# EAGLE design sb7pads (EAGLE 9.4.2)
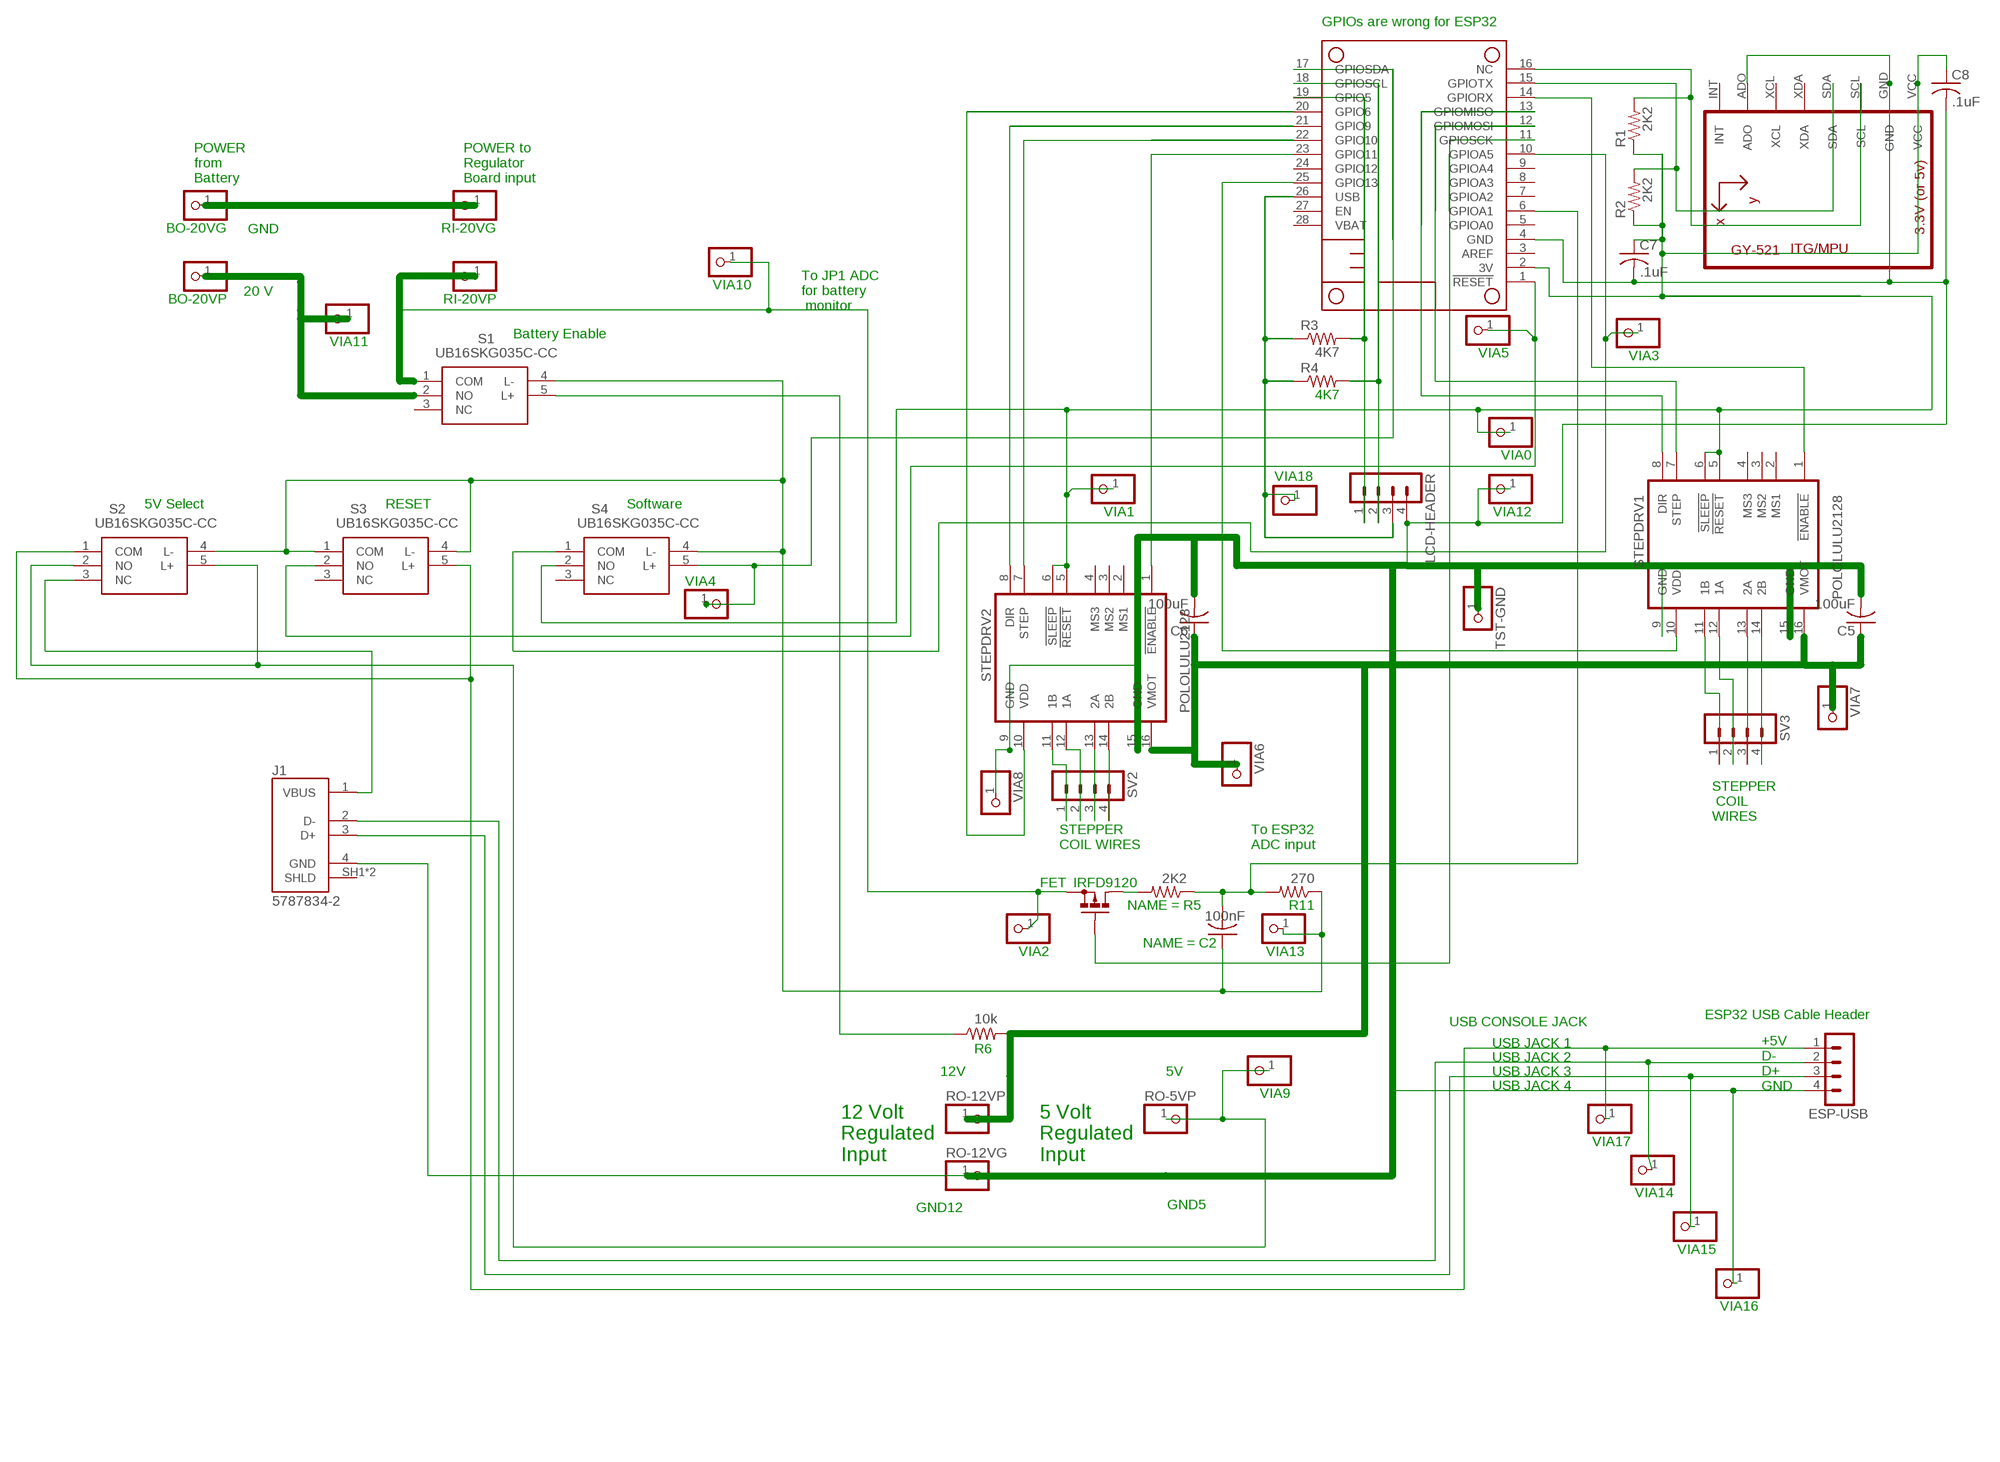
[diagram p0: schematic, sheet 1]

## Parts
BO-20VG  PINHD-1X1  [1X01]
BO-20VP  PINHD-1X1  [1X01]
C2  100nF  C-US050-025X075  [C050-025X075]
C5  100uF  C-US050-024X044  [C050-024X044]
C6  100uF  C-US050-024X044  [C050-024X044]
C7  .1uF  C-US050-024X044  [C050-024X044]
C8  .1uF  C-US050-024X044  [C050-024X044]
ESP-USB  MA04-1  [MA04-1]
FET  IRFD9120  [C370-01]
J1  5787834-2  [TE_5787834-2]
LCD-HEADER  MA04-1  [MA04-1]
MS2  FEATHERWING_NOHOLES  [FEATHERWING_NOHOLES]
R1  2K2  R-US_0309/12  [0309/12]
R2  2K2  R-US_0309/12  [0309/12]
R3  4K7  R-US_0309/12  [0309/12]
R4  4K7  R-US_0309/12  [0309/12]
R5  2K2  R-US_0207/10  [0207/10]
R6  10k  R-US_0207/10  [0207/10]
R11  270  R-US_0207/10  [0207/10]
RI-20VG  PINHD-1X1  [1X01]
RI-20VP  PINHD-1X1  [1X01]
RO-5VP  PINHD-1X1  [1X01]
RO-12VG  PINHD-1X1  [1X01]
RO-12VP  PINHD-1X1  [1X01]
S1  UB16SKG035C-CC  [UB16SKG035CCC]
S2  UB16SKG035C-CC  [UB16SKG035CCC]
S3  UB16SKG035C-CC  [UB16SKG035CCC]
S4  UB16SKG035C-CC  [UB16SKG035CCC]
STEPDRV1  POLOLULU2128  [POLOLULU2128]
STEPDRV2  POLOLULU2128  [POLOLULU2128]
SV2  MA04-1  [MA04-1]
SV3  MA04-1  [MA04-1]
TST-GND  PINHD-1X1  [1X01]
U1  GY-521MPU6050  [GY-521]
VIA0  PINHD-1X1  [1X01]
VIA1  PINHD-1X1  [1X01]
VIA2  PINHD-1X1  [1X01]
VIA3  PINHD-1X1  [1X01]
VIA4  PINHD-1X1  [1X01]
VIA5  PINHD-1X1  [1X01]
VIA6  PINHD-1X1  [1X01]
VIA7  PINHD-1X1  [1X01]
VIA8  PINHD-1X1  [1X01]
VIA9  PINHD-1X1  [1X01]
VIA10  PINHD-1X1  [1X01]
VIA11  PINHD-1X1  [1X01]
VIA12  PINHD-1X1  [1X01]
VIA13  PINHD-1X1  [1X01]
VIA14  PINHD-1X1  [1X01]
VIA15  PINHD-1X1  [1X01]
VIA16  PINHD-1X1  [1X01]
VIA17  PINHD-1X1  [1X01]
VIA18  PINHD-1X1  [1X01]

## Nets
3V: C7.1 C8.1 MS2.2(3V) R1.1 R2.1 S4.2(NO) STEPDRV1.5(!RESET) STEPDRV1.6(!SLEEP) STEPDRV2.5(!RESET) STEPDRV2.6(!SLEEP) U1.VCC VIA0.1 VIA1.1
N$1: MS2.25(GPIO13) STEPDRV1.10(VDD)
N$2: FET.G MS2.11(GPIOSCK)
N$3: BO-20VP.1 S1.2(NO) VIA11.1
N$4: MS2.1(!RESET) S3.2(NO) VIA5.1
N$5: MS2.21(GPIO9) STEPDRV2.8(DIR)
N$6: FET.S RI-20VP.1 S1.1(COM) VIA2.1 VIA10.1
N$7: MS2.14(GPIORX) STEPDRV1.1(!ENABLE)
N$8: STEPDRV2.14(2B) SV2.4
N$11: LCD-HEADER.1 MS2.19(GPIO5) R3.2
N$12: STEPDRV2.13(2A) SV2.3
N$13: STEPDRV2.12(1A) SV2.2
N$14: STEPDRV2.11(1B) SV2.1
N$15: MS2.12(GPIOMOSI) STEPDRV1.7(STEP)
N$16: STEPDRV1.14(2B) SV3.4
N$17: MS2.16(NC) R1.2 U1.SCL
N$18: STEPDRV1.13(2A) SV3.3
N$19: STEPDRV1.12(1A) SV3.2
N$20: STEPDRV1.11(1B) SV3.1
N$21: BO-20VG.1 RI-20VG.1
N$22: ESP-USB.2 J1.2(D-) VIA14.1
N$23: ESP-USB.3 J1.3(D+) VIA15.1
N$24: MS2.13(GPIOMISO) STEPDRV1.8(DIR)
N$25: MS2.15(GPIOTX) R2.2 U1.SDA
N$27: C5.2 C6.2 C7.2 C8.2 ESP-USB.4 J1.4(GND) LCD-HEADER.4 MS2.4(GND) RO-12VG.1 STEPDRV1.9(GND) STEPDRV1.15(GND) STEPDRV2.9(GND) STEPDRV2.15(GND) TST-GND.1 U1.ADO U1.GND VIA8.1 VIA12.1 VIA16.1
N$28: RO-5VP.1 S2.2(NO) S2.5(L+) VIA9.1
N$29: MS2.17(GPIOSDA) S4.5(L+) VIA4.1
N$30: C2.2 MS2.6(GPIOA1) R5.1 R11.2
N$31: R6.1 S1.5(L+)
N$33: ESP-USB.1 S2.1(COM) S3.5(L+) VIA17.1
N$34: MS2.22(GPIO10) STEPDRV2.7(STEP)
N$35: LCD-HEADER.2 MS2.18(GPIOSCL) R4.2
N$36: MS2.20(GPIO6) STEPDRV2.10(VDD)
N$37: MS2.23(GPIO11) STEPDRV2.1(!ENABLE)
N$44: MS2.10(GPIOA5) S4.1(COM) VIA3.1
N$45: C5.1 C6.1 R6.2 RO-12VP.1 STEPDRV1.16(VMOT) STEPDRV2.16(VMOT) VIA6.1 VIA7.1
N$50: J1.1(VBUS) S2.3(NC)
N$51: FET.D FET.D1(D) R5.2
N$56: C2.1 R11.1 S1.4(L-) S2.4(L-) S3.1(COM) S3.4(L-) S4.4(L-) VIA13.1
USB: LCD-HEADER.3 MS2.26(USB) R3.1 R4.1 VIA18.1
Unconnected: J1.SH1(SHLD) J1.SH2(SHLD) MS2.3(AREF) MS2.5(GPIOA0) MS2.7(GPIOA2) MS2.8(GPIOA3) MS2.9(GPIOA4) MS2.24(GPIO12) MS2.27(EN) MS2.28(VBAT) S1.3(NC) S3.3(NC) S4.3(NC) STEPDRV1.2(MS1) STEPDRV1.3(MS2) STEPDRV1.4(MS3) STEPDRV2.2(MS1) STEPDRV2.3(MS2) STEPDRV2.4(MS3) U1.INT U1.XCL U1.XDA

## Notes on the sheet
- GPIOs are wrong for ESP32
- POWER
  from
  Battery
- POWER to
  Regulator
  Board input
- GND
- 20 V
- To JP1 ADC
  for battery
   monitor
- Battery Enable
- 5V Select | RESET | Software
- STEPPER
   COIL
  WIRES
- STEPPER
  COIL WIRES
- To ESP32
  ADC input
- ESP32 USB Cable Header
- USB CONSOLE JACK
- USB JACK 1
- USB JACK 2
- 12V | 5V | USB JACK 3
- USB JACK 4
- +5V
  D-
  D+
  GND
- 12 Volt
  Regulated
  Input
- 5 Volt
  Regulated
  Input
- GND12 | GND5

## Library data of the parts
BO-20VG BO-20VP RI-20VG RI-20VP RO-5VP RO-12VG RO-12VP TST-GND VIA0 VIA1-VIA18 = pinhead:PINHD-1X1: PIN HEADER
C2 C5-C8 = rcl:C-US: CAPACITOR, American symbol; SPICEPREFIX: C
ESP-USB LCD-HEADER SV2 SV3 = con-lstb:MA04-1: PIN HEADER; OC_FARNELL: unknown; OC_NEWARK: unknown
FET = transistor-small-signal:IRFD9120: P-CHANNEL MOS FET
J1 = 5787834-2:5787834-2: Conn USB 2.0 Type B RCP 4 POS 2.5mm Solder ST Thru-Hole 4 Terminal 1 Port Box/Tray; COMMENT: 5787834-2; DESCRIPTION: Conn USB 2.0 Type B RCP 4 POS 2.5mm Solder ST Thru-Hole 4 Terminal 1 Port Box/Tray; DIGI-KEY_PART_NUMBER: A121598-ND; DIGI-KEY_PURCHASE_URL: https://www.digikey.com/product-detail/en/te-connectivity-amp-connectors/5787834-2/A121598-ND/2286710?utm_source=snapeda&utm_medium=aggregator&utm_campaign=symbol; EU_ROHS_COMPLIANCE: Compliant; MF: TE Connectivity; MP: 5787834-2; PACKAGE: None; TE_PURCHASE_URL: https://www.te.com/usa-en/product-5787834-2.html?te_bu=Cor&te_type=disp&te_campaign=seda_glo_cor-seda-global-disp-prtnr-fy19-seda-model-bom-cta_sma-317_1&elqCampaignId=32493
MS2 = microbuilder:FEATHERWING
R1-R4 = resistor:R-US_: RESISTOR, American symbol
R5 R6 R11 = rcl:R-US_: RESISTOR, American symbol; SPICEPREFIX: R
S1-S4 = UB16SKG035C-CC:UB16SKG035C-CC: Pushbutton Switches ON-ON SQ .4VA RED LED & CAP PC TERM Source: Datasheet <https://www.mouser.com/datasheet/2/295/UBIlluminated-33436.pdf>; ALLIED_NUMBER: 71044456; ALLIED_PRICE-STOCK: https://www.alliedelec.com/nkkswitches-ub16skg035c-cc/71044456/; DESCRIPTION: Pushbutton Switches ON-ON SQ .4VA RED LED & CAP PC TERM; HEIGHT: 13.5mm; MANUFACTURER_NAME: NKK Switches; MANUFACTURER_PART_NUMBER: UB16SKG035C-CC; MOUSER_PART_NUMBER: 633-UB16SKG035CCC; MOUSER_PRICE-STOCK: https://www.mouser.com/Search/Refine.aspx?Keyword=633-UB16SKG035CCC
STEPDRV1 STEPDRV2 = stepper_drivers_etc:POLOLULU2128
U1 = gy-521a:GY-521

## Board
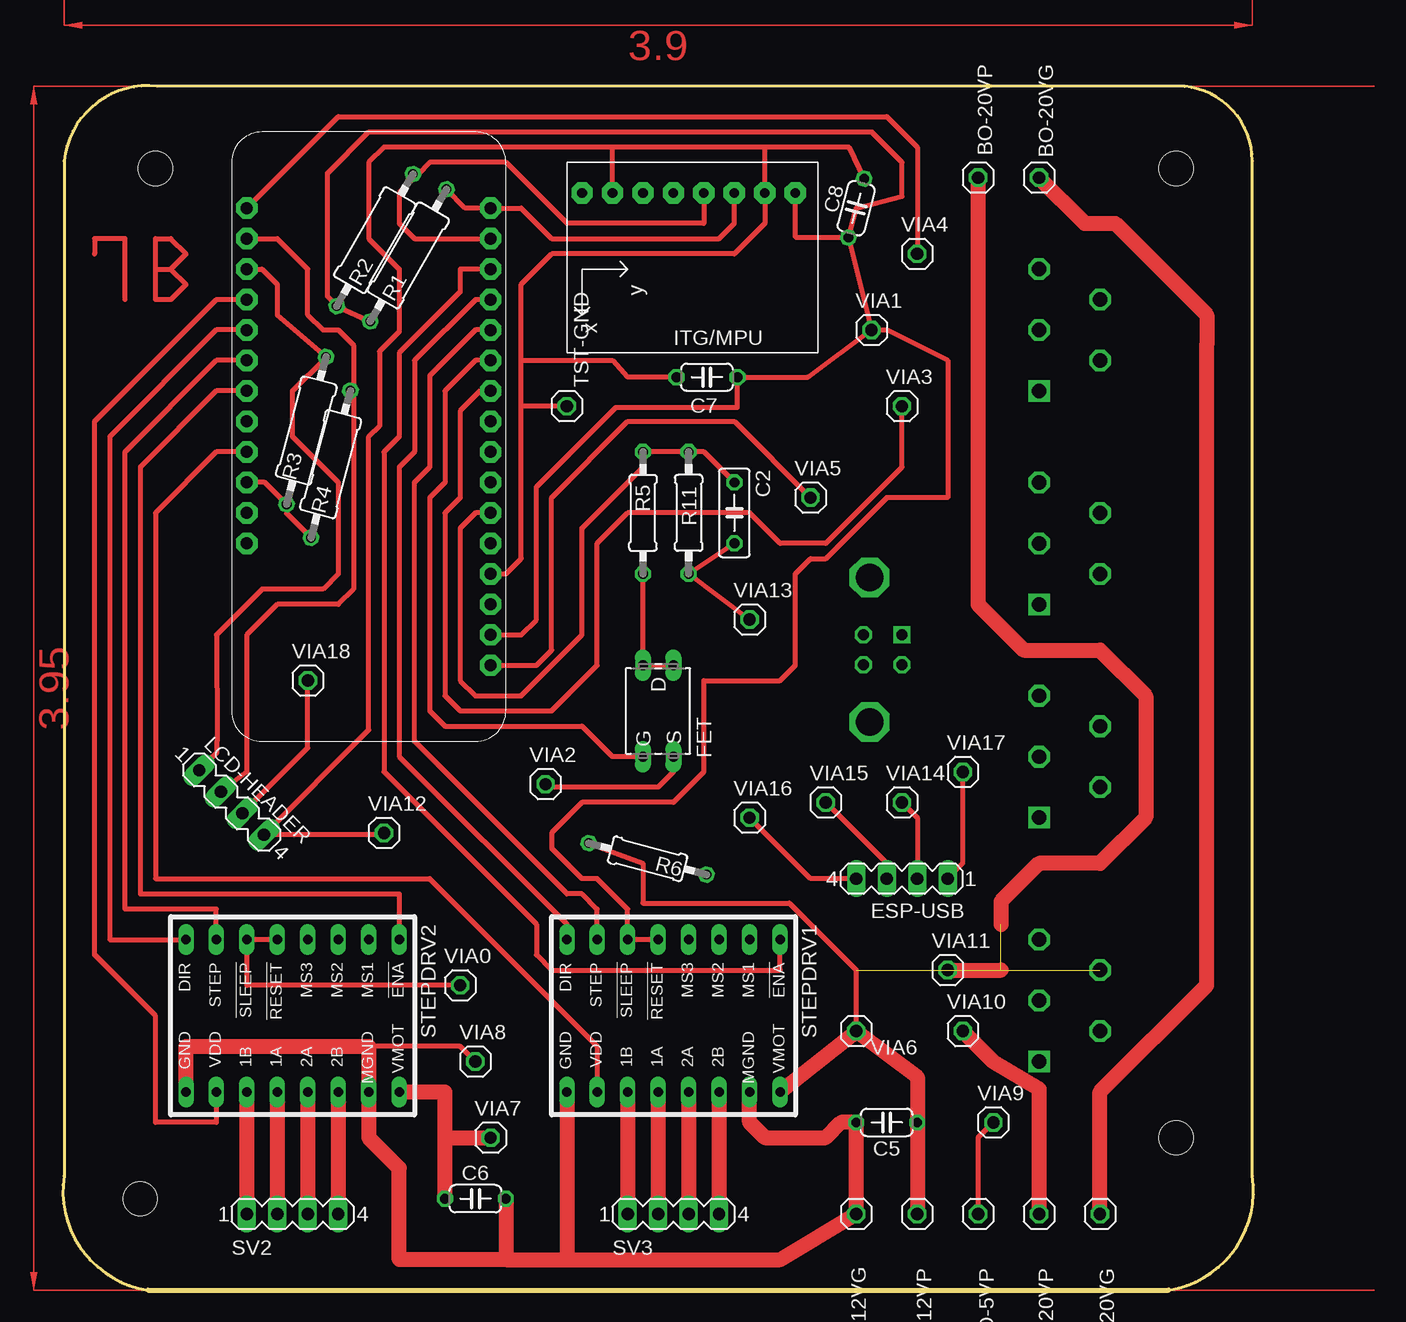
[diagram p1: board, top side]
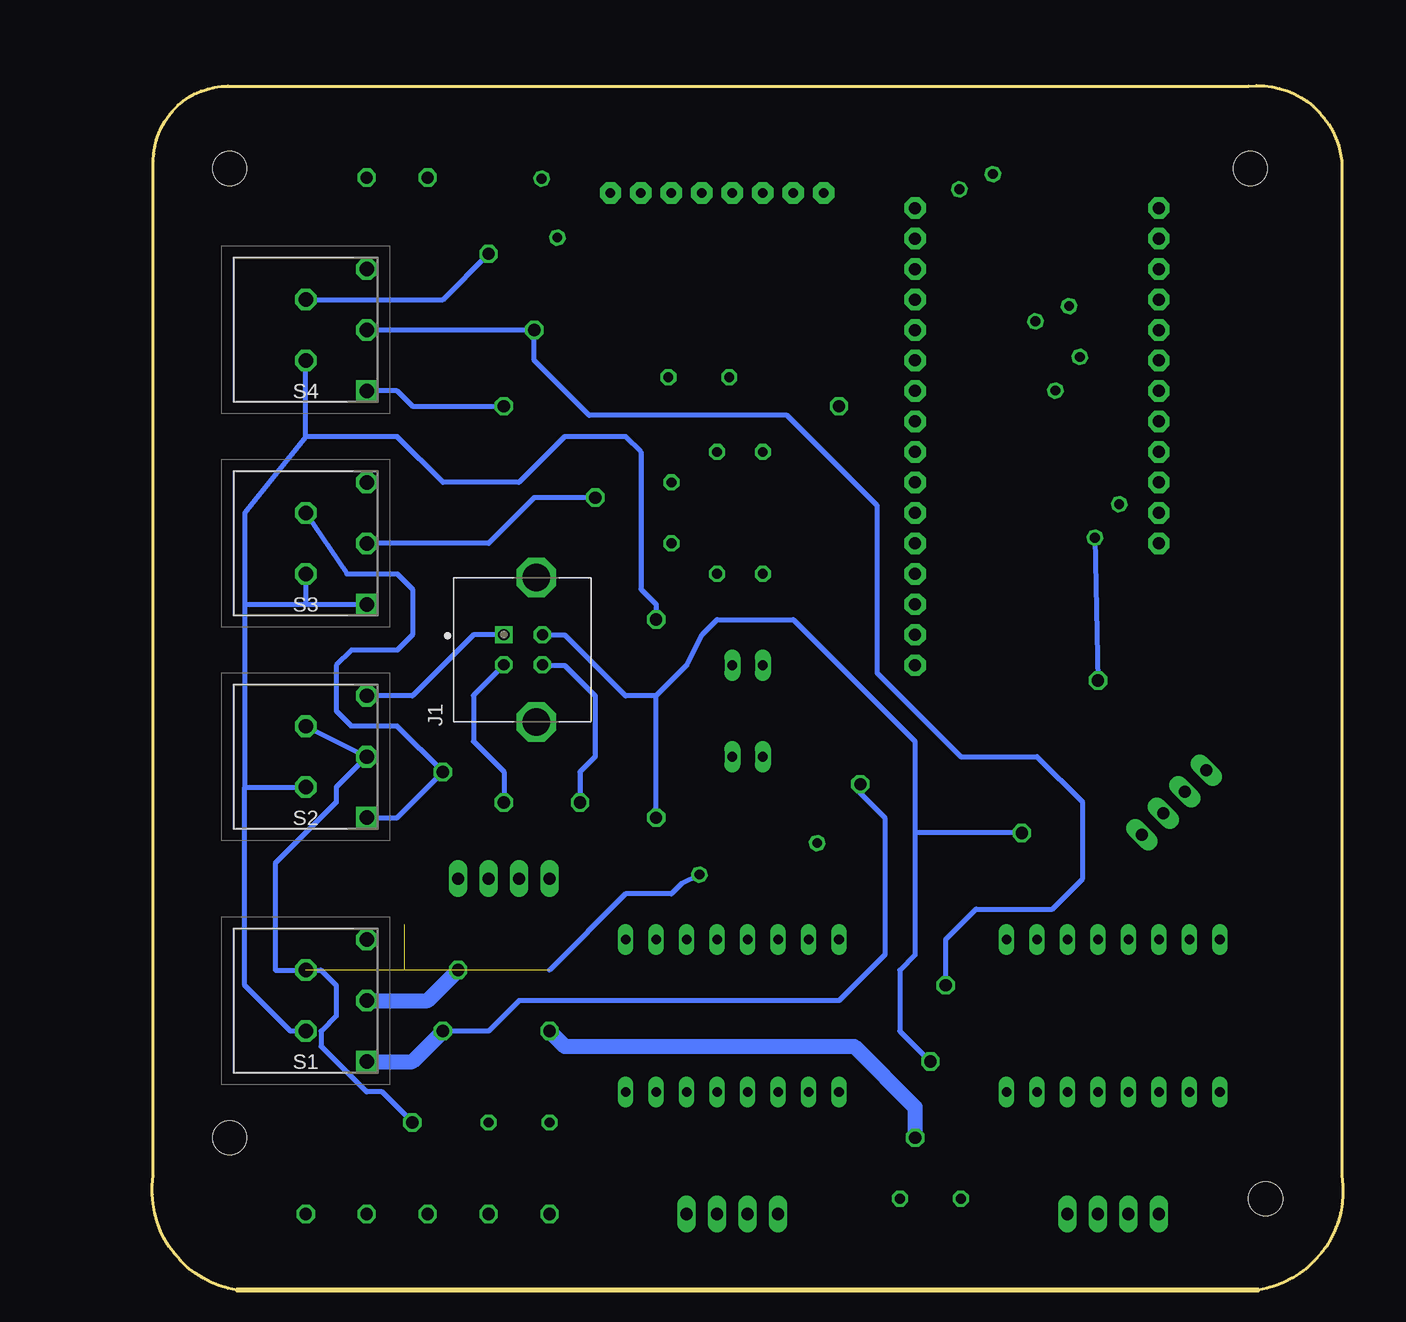
[diagram p2: board, bottom side, seen from below]

Size 99.25 x 100.37 mm. Coordinates in mm from the lower left corner, seen from the top.
Outline: 99.15,94.11 arc90 92.93,100.33 7.84,100.33 arc90 0.09,94.11 0.09,9.53 arc90 7.08,0 92.17,0 arc90 99.15,9.53 99.15,94.11
Copper layers (1*16): Top 0.035mm / dielectric 1.5mm / Bottom 0.035mm
Design rules "default": minimum track width 6mil, minimum drill 0.35mm, track to track 6mil, track to pad 6mil, pad to pad 6mil, via to via 6mil, smd to smd 6mil, copper to edge 40mil, drill to drill 6mil, minimum pad ring 10mil, minimum via ring 8mil, stop-mask expansion 4mil, vias tented up to drill 0mil, thermal gap 10mil
Holes 2.85 mm at 92.8,93.47 6.44,7.62 7.71,93.47 92.8,12.7

### Footprints (pad centres in the part's own frame; a part is rotated, then mirrored left to right if it is on the bottom)
1X01 = drill 1.016 octagon: 1 0,0
C050-025X075 = drill 0.813 octagon: 1 -2.54,0; 2 2.54,0
C050-024X044 = drill 0.813 octagon: 1 -2.54,0; 2 2.54,0
MA04-1 = drill 1.016 long: 1 -3.81,0; 2 -1.27,0; 3 1.27,0; 4 3.81,0
C370-01 = drill 0.813 long: D -3.81,1.27; D1 -3.81,-1.27; G 3.81,-1.27; S 3.81,1.27
TE_5787834-2 = drill 0.92 square: 1 0,0 | drill 0.92 octagon: 2 -2.5,0; 3 -2.5,-3.21; 4 0,-3.21 | drill 2.3 octagon: SH1 -7.27,-2.705; SH2 4.77,-2.705
FEATHERWING_NOHOLES = drill 1 pad 1.778 octagon: 1 6.35,1.27; 2 8.89,1.27; 3 11.43,1.27; 4 13.97,1.27; 5 16.51,1.27; 6 19.05,1.27; 7 21.59,1.27; 8 24.13,1.27; 9 26.67,1.27; 10 29.21,1.27; 11 31.75,1.27; 12 34.29,1.27; 13 36.83,1.27; 14 39.37,1.27; 15 41.91,1.27; 16 44.45,1.27; 17 44.45,21.59; 18 41.91,21.59; 19 39.37,21.59; 20 36.83,21.59; 21 34.29,21.59; 22 31.75,21.59; 23 29.21,21.59; 24 26.67,21.59; 25 24.13,21.59; 26 21.59,21.59; 27 19.05,21.59; 28 16.51,21.59
0309/12 = drill 0.813 octagon: 1 -6.35,0; 2 6.35,0
0207/10 = drill 0.813 octagon: 1 -5.08,0; 2 5.08,0
UB16SKG035CCC = drill 1.2 pad 1.8 square: 1 0,0 | drill 1.2 pad 1.8 octagon: 2 0,5.08; 3 0,10.16; 4 -5.08,2.54; 5 -5.08,7.62
POLOLULU2128 = drill 0.8 long: 1 -7.62,7.62; 2 -7.62,5.08; 3 -7.62,2.54; 4 -7.62,0; 5 -7.62,-2.54; 6 -7.62,-5.08; 7 -7.62,-7.62; 8 -7.62,-10.16; 9 5.08,-10.16; 10 5.08,-7.62; 11 5.08,-5.08; 12 5.08,-2.54; 13 5.08,0; 14 5.08,2.54; 15 5.08,5.08; 16 5.08,7.62
GY-521 = drill 0.8 pad 1.778 octagon: ADO -8.89,-6.35; GND -8.89,6.35; INT -8.89,-8.89; SCL -8.89,3.81; SDA -8.89,1.27; VCC -8.89,8.89; XCL -8.89,-3.81; XDA -8.89,-1.27

### Placement (x,y rotation side)
BO-20VG  81.37,92.71 0 top
BO-20VP  76.29,92.71 0 top
C2  55.97,64.77 90 top
C5  68.67,13.97 180 top
C6  34.38,7.62 0 top
C7  53.69,76.07 180 top
C8  66.13,90.17 75 top
ESP-USB  69.94,34.29 180 top
FET  49.62,48.26 270 top
J1  69.94,54.61 90 bottom
LCD-HEADER  14.06,40.64 315 top
MS2  36.92,45.72 90 top
R1  28.79,86.23 60 top
R2  26,87.5 60 top
R3  20.29,71.63 75 top
R4  22.32,68.83 75 top
R5  48.35,64.77 270 top
R6  48.73,35.94 165 top
R11  52.16,64.77 90 top
RI-20VG  86.45,6.35 0 top
RI-20VP  81.37,6.35 0 top
RO-5VP  76.29,6.35 0 top
RO-12VG  66.13,6.35 0 top
RO-12VP  71.21,6.35 0 top
S1  81.37,19.05 0 bottom
S2  81.37,39.37 0 bottom
S3  81.37,57.15 0 bottom
S4  81.37,74.93 0 bottom
STEPDRV1  52.16,21.59 270 top
STEPDRV2  20.41,21.59 270 top
SV2  19.14,6.35 0 top
SV3  50.89,6.35 0 top
TST-GND  42,73.66 0 top
U1  52.16,82.55 270 top
VIA0  33.11,25.4 0 top
VIA1  67.4,80.01 0 top
VIA2  40.22,42.16 0 top
VIA3  69.94,73.66 0 top
VIA4  71.21,86.36 0 top
VIA5  62.32,66.04 0 top
VIA6  66.13,21.59 0 top
VIA7  35.65,12.7 0 top
VIA8  34.38,19.05 0 top
VIA9  77.56,13.97 0 top
VIA10  75.02,21.59 0 top
VIA11  73.75,26.67 0 top
VIA12  26.76,38.1 0 top
VIA13  57.24,55.88 0 top
VIA14  69.94,40.64 0 top
VIA15  63.59,40.64 0 top
VIA16  57.24,39.37 0 top
VIA17  75.02,43.18 0 top
VIA18  20.41,50.8 0 top

### Tracks (layer width: path | path; a pad name or v marks a point on that pad's centre or on a via)
3V
  Top 0.406: MS2.2 38.19,54.61 39.46,55.88 39.46,66.93 46.07,73.53 56.23,73.53 C7.1 62.1,76.07 VIA1.1 | STEPDRV1.5 STEPDRV1.6 47.08,31.75 44.54,34.29 43.27,34.29 40.73,36.83 40.73,38.1 43.27,40.64 50.89,40.64 53.43,43.18 53.43,50.8 59.78,50.8 61.05,52.07 61.05,59.69 62.32,60.96 63.59,60.96 68.67,66.04 73.75,66.04 73.75,77.47 68.67,80.01 VIA1.1 | STEPDRV2.5 STEPDRV2.6 15.33,25.4 VIA0.1 | R1.1 R2.1 22.83,82.04 22.06,82.8 22.06,93.09 25.49,96.52 67.4,96.52 69.94,93.98 69.94,91.14 66.13,90.17 C8.1 | U1.VCC 61.05,87.8 61.14,87.72 C8.1 | C8.1 VIA1.1
  Bottom 0.406: VIA0.1 33.11,29.21 30.57,31.75 24.22,31.75 21.68,34.29 21.68,40.64 25.49,44.45 31.84,44.45 38.83,51.44 38.83,65.41 46.32,72.9 62.83,72.9 67.4,77.47 VIA1.1 S4.2
N$1
  Top 0.406: STEPDRV1.10 44.54,20.32 30.57,34.29 7.71,34.29 7.71,64.77 12.79,69.85 MS2.25
N$2
  Top 0.406: MS2.11 34.38,77.47 31.84,74.93 31.84,67.31 30.57,66.04 30.57,48.26 31.84,46.99 43.27,46.99 45.81,44.45 FET.G
N$3  (1 unrouted)
  Top 1.27: BO-20VP.1 76.29,57.15 80.1,53.34 86.45,53.34 90.26,49.53 90.26,39.37 86.45,35.56 81.37,35.56 78.2,32.38 78.2,30.48 | VIA11.1 78.2,26.67
  Bottom 1.27: S1.2 76.29,24.13 VIA11.1
N$4
  Top 0.406: MS2.1 39.46,52.07 40.73,53.34 40.73,66.04 47.08,72.39 55.97,72.39 VIA5.1
  Bottom 0.406: S3.2 71.21,62.23 67.4,66.04 VIA5.1
N$5
  Top 0.406: MS2.21 12.79,80.01 3.9,71.12 3.9,29.21 STEPDRV2.8
N$6
  Top 0.406: FET.S 50.89,43.18 49.62,41.91 40.73,41.91 40.48,42.16 VIA2.1
  Top 1.27: RI-20VP.1 81.37,16.76 77.56,19.05 VIA10.1
  Bottom 0.406: VIA2.1 40.22,41.4 38.19,39.37 38.19,27.94 42,24.13 68.67,24.13 71.21,21.59 VIA10.1
  Bottom 1.27: S1.1 77.56,19.05 VIA10.1
N$7
  Top 0.406: MS2.14 33.11,85.09 33.11,83.19 28.03,78.11 28.03,71.12 26.76,69.85 26.76,43.18 39.46,30.48 39.46,27.94 40.73,26.67 59.78,26.67 STEPDRV1.1
N$8
  Top 1.27: STEPDRV2.14 SV2.4
N$10
  Top 0.406: 5.17,82.55 5.17,87.63 2.63,87.63 2.63,86.36
N$11
  Top 0.406: MS2.19 16.6,85.09 17.87,83.82 17.87,81.27 R3.2 21.93,77.72 19.14,74.93 19.14,71.12 22.95,67.31 22.95,59.69 21.68,58.42 16.6,58.42 12.81,54.63 12.81,54.61 12.85,45.72 12.85,44.82 LCD-HEADER.1
N$12
  Top 1.27: STEPDRV2.13 SV2.3
N$13
  Top 1.27: STEPDRV2.12 SV2.2
N$14
  Top 1.27: STEPDRV2.11 SV2.1
N$15
  Top 0.406: MS2.12 34.38,80.01 30.57,76.2 30.57,68.58 29.3,67.31 29.3,45.72 42,33.02 43.27,33.02 44.54,31.75 STEPDRV1.7
N$16
  Top 1.27: STEPDRV1.14 SV3.4
N$17
  Top 0.406: U1.SCL 55.97,88.9 54.7,87.63 40.73,87.63 38.19,90.17 MS2.16 33.53,90.17 R1.2
N$18
  Top 1.27: STEPDRV1.13 SV3.3
N$19
  Top 1.27: STEPDRV1.12 SV3.2
N$20
  Top 1.27: STEPDRV1.11 SV3.1
N$21
  Top 1.27: RI-20VG.1 86.45,16.51 95.34,25.4 95.34,78.74 95.34,81.28 87.72,88.9 85.18,88.9 BO-20VG.1
N$22
  Top 0.406: VIA14.1 71.21,39.37 ESP-USB.2
  Bottom 0.406: J1.2 72.48,49.57 72.48,45.72 69.94,43.18 VIA14.1
N$23
  Top 0.406: ESP-USB.3 68.67,35.56 VIA15.1
  Bottom 0.406: J1.3 66.69,52.07 64.86,52.07 62.32,49.53 62.32,44.45 63.59,43.18 VIA15.1
N$24
  Top 0.406: MS2.13 34.38,82.55 29.3,77.47 29.3,69.85 28.03,68.58 28.03,44.45 42,30.48 STEPDRV1.8
N$25
  Top 0.152: R2.2 29.18,92.58
  Top 0.406: MS2.15 29.3,87.63 28.03,88.9 28.03,91.44 29.18,92.58 | U1.SDA 53.43,88.9 42,88.9 36.92,93.98 30.57,93.98 29.59,93 R2.2
N$26
  Top 0.406: 7.71,85.09 7.71,82.55 8.98,82.55 10.25,83.82 8.98,85.09 | 7.71,85.09 7.71,87.63 8.98,87.63 10.25,86.36 8.98,85.09 | 7.71,85.09 8.98,85.09
N$27
  Top 0.406: 58.51,95.25 65.52,95.25 C8.2 | 58.51,95.25 45.81,95.25 | 45.81,95.25 26.76,95.25 25.49,93.98 25.49,87.63 28.03,85.09 28.03,79.88 26.38,78.23 26.38,72.01 25.49,71.12 25.49,46.68 LCD-HEADER.4 26.61,37.95 VIA12.1 | MS2.4 36.92,59.69 38.19,60.96 38.19,73.66 | 38.19,77.47 38.19,83.82 40.73,86.36 55.97,86.36 58.51,88.9 U1.GND 58.51,95.25 | U1.ADO 45.81,95.25 | 38.19,73.66 38.19,77.47 | VIA8.1 33.11,20.32 25.49,20.32 | ESP-USB.4 62.32,34.29 VIA16.1 | C7.2 47.08,76.07 45.81,77.47 38.19,77.47 | TST-GND.1 38.19,73.66
  Top 1.27: 36.92,2.54 28.03,2.54 28.03,10.16 25.49,12.7 STEPDRV2.15 25.49,20.32 10.25,20.32 STEPDRV2.9 | 36.92,2.54 42,2.54 | STEPDRV1.9 42,2.54 | 42,2.54 59.78,2.54 RO-12VG.1 C5.2 64.86,13.97 63.59,12.7 58.51,12.7 57.24,13.97 STEPDRV1.15 | C6.2 36.92,2.54
  Bottom 0.406: J1.4 64.86,54.61 59.78,49.53 57.24,49.53 | 35.65,38.1 35.65,45.72 45.81,55.88 52.16,55.88 53.43,54.61 54.7,52.07 57.24,49.53 | 35.65,38.1 35.65,27.94 36.92,26.67 36.92,21.59 VIA8.1 | VIA12.1 35.65,38.1 | VIA16.1 57.24,49.53
N$28
  Top 0.406: VIA9.1 76.29,12.7 RO-5VP.1
  Bottom 0.406: S2.5 S2.2 83.91,41.91 83.91,40.64 88.99,35.56 88.99,26.67 85.18,26.67 83.91,25.4 83.91,22.86 85.18,21.59 85.18,20.32 81.37,16.51 80.1,16.51 VIA9.1
N$29
  Top 0.406: MS2.17 22.95,97.79 68.67,97.79 71.21,95.25 VIA4.1
  Bottom 0.406: S4.5 75.02,82.55 VIA4.1
N$30
  Top 0.406: MS2.6 34.38,64.77 33.11,63.5 33.11,50.8 34.38,49.53 38.19,49.53 43.27,54.61 43.27,63.5 48.35,68.58 R5.1 R11.2 53.43,69.85 C2.2
N$31  (1 unrouted)
  Bottom 0.406: R6.1 55.1,33.89 55.97,33.02 59.78,33.02 66.13,26.67
N$33
  Top 0.406: ESP-USB.1 75.02,35.56 VIA17.1
  Bottom 0.406: S2.1 78.83,39.37 VIA17.1 78.83,46.99 82.64,46.99 83.91,48.26 83.91,52.07 82.64,53.34 78.83,53.34 77.56,54.61 77.56,58.42 78.83,59.69 83.02,59.69 S3.5
N$34
  Top 0.406: MS2.22 12.79,77.47 5.17,69.85 5.17,31.75 12.79,31.75 STEPDRV2.7
N$35
  Top 0.406: MS2.18 17.87,87.63 20.41,85.09 20.41,81.28 21.68,80.01 22.95,80.01 24.22,78.74 24.22,74.93 | 24.22,74.93 24.18,74.97 R4.2 | 24.22,74.93 24.22,58.42 22.95,57.15 17.87,57.15 15.33,54.61 15.33,43.18 LCD-HEADER.2
N$36
  Top 0.406: MS2.20 12.79,82.55 2.63,72.39 2.63,27.94 7.71,22.86 7.71,13.97 12.79,13.97 STEPDRV2.10
N$37
  Top 0.406: MS2.23 12.79,74.93 6.44,68.58 6.44,33.02 28.03,33.02 STEPDRV2.1
N$44
  Top 0.406: MS2.10 34.76,74.93 33.11,73.28 33.11,66.04 31.84,64.77 31.84,49.53 33.11,48.26 40.73,48.26 44.54,52.07 44.54,62.23 47.08,64.77 57.24,64.77 59.78,62.23 63.59,62.23 69.94,68.58 VIA3.1
  Bottom 0.406: S4.1 78.83,74.93 77.56,73.66 VIA3.1
N$45
  Top 0.406: VIA6.1 66.13,26.67 60.54,32.26 48.35,32.26 48.35,35.56 R6.2
  Top 1.27: STEPDRV2.16 31.84,16.51 31.84,12.7 | 31.84,12.7 VIA7.1 | C6.1 31.84,12.7 | RO-12VP.1 C5.1 71.21,17.78 VIA6.1 STEPDRV1.16
  Bottom 1.27: VIA6.1 64.86,20.32 40.73,20.32 35.65,15.24 VIA7.1
N$50
  Bottom 0.406: J1.1 72.48,54.61 77.56,49.53 S2.3
N$51
  Top 0.406: FET.D FET.D1 R5.2
N$56
  Top 0.406: VIA13.1 R11.1 C2.1
  Bottom 0.406: 91.53,57.15 91.53,64.77 86.45,71.12 | 91.53,57.15 86.45,57.15 | 86.45,57.15 S3.1 | S3.4 86.45,57.15 | 91.53,57.15 91.53,41.91 | 91.53,41.91 S2.4 | S1.4 87.72,21.59 91.53,25.4 91.53,41.91 | 86.45,71.12 78.83,71.12 75.02,67.31 68.67,67.31 64.86,71.12 59.78,71.12 58.51,69.85 58.51,58.42 57.24,57.15 VIA13.1 | 86.45,71.12 S4.4
USB
  Top 0.406: MS2.26 16.83,67.31 R3.1 18.64,64.73 R4.1 | LCD-HEADER.3 20.41,45.19 VIA18.1
  Bottom 0.406: R4.1 VIA18.1
(copper drawn outside any net)
  shapes: Top area x2